# Altium schematic sheet RelayController.SchDoc
size A4
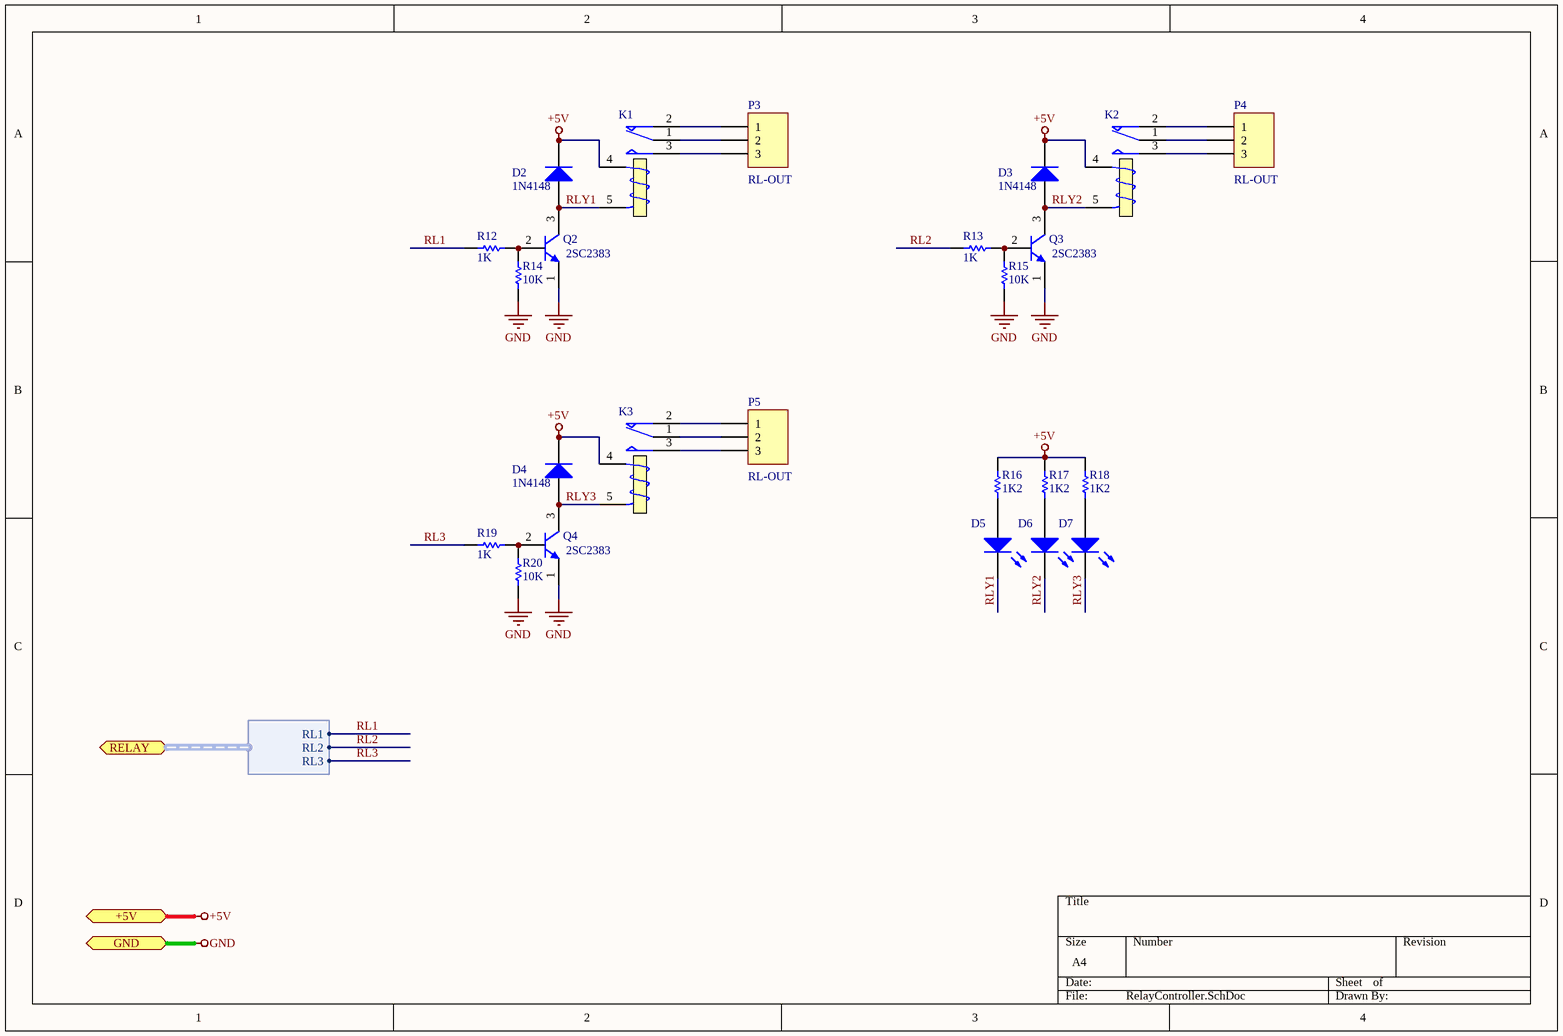
[diagram p0: RelayController.SchDoc]

## Parts
D2  1N4148  [D-DO213-AA]
D3  1N4148  [D-DO213-AA]
D4  1N4148  [D-DO213-AA]
D5  SMD0805-RED  [LED-0805]  (value not drawn)
D6  SMD0805-RED  [LED-0805]  (value not drawn)
D7  SMD0805-RED  [LED-0805]  (value not drawn)
K1  RL-5P-10A  [RL-5P-10A]  (value not drawn)
K2  RL-5P-10A  [RL-5P-10A]  (value not drawn)
K3  RL-5P-10A  [RL-5P-10A]  (value not drawn)
P3  value RL-OUT  [TER-KF128-3P]  (hidden comment: KF128-3P)
P4  value RL-OUT  [TER-KF128-3P]  (hidden comment: KF128-3P)
P5  value RL-OUT  [TER-KF128-3P]  (hidden comment: KF128-3P)
Q2  value 2SC2383  [TO-92AB]  (hidden comment: C2383)
Q3  value 2SC2383  [TO-92AB]  (hidden comment: C2383)
Q4  value 2SC2383  [TO-92AB]  (hidden comment: C2383)
R12  1K  [R-0805]
R13  1K  [R-0805]
R14  10K  [R-0805]
R15  10K  [R-0805]
R16  1K2  [R-0805]
R17  1K2  [R-0805]
R18  1K2  [R-0805]
R19  1K  [R-0805]
R20  10K  [R-0805]

## Ports
+5V, GND, RELAY (harness RELAY)

## Harnesses
RELAY: RL1, RL2, RL3

## Nets
+5V: D2.2(K) D3.2(K) D4.2(K) K1.4(T1) K2.4(T1) K3.4(T1) R16.2 R17.2 R18.2 ; port +5V
GND: Q2.1(E) Q3.1(E) Q4.1(E) R14.2 R15.2 R20.2 ; port GND
RL1: R12.2 ; port RELAY.RL1
RL2: R13.2 ; port RELAY.RL2
RL3: R19.2 ; port RELAY.RL3
RLY1: D2.1(A) D5.2(K) K1.5(T2) Q2.3(C)
RLY2: D3.1(A) D6.2(K) K2.5(T2) Q3.3(C)
RLY3: D4.1(A) D7.2(K) K3.5(T2) Q4.3(C)
NetD5_1: D5.1(A) R16.1
NetD6_1: D6.1(A) R17.1
NetD7_1: D7.1(A) R18.1
NetK1_1: K1.1(COM) P3.2
NetK1_2: K1.2(NC) P3.1
NetK1_3: K1.3(NO) P3.3
NetK2_1: K2.1(COM) P4.2
NetK2_2: K2.2(NC) P4.1
NetK2_3: K2.3(NO) P4.3
NetK3_1: K3.1(COM) P5.2
NetK3_2: K3.2(NC) P5.1
NetK3_3: K3.3(NO) P5.3
NetQ2_2: Q2.2(B) R12.1 R14.1
NetQ3_2: Q3.2(B) R13.1 R15.1
NetQ4_2: Q4.2(B) R19.1 R20.1

## Library data of the parts
D2-D4 = Diode 1N4148: High Conductance Fast Diode; Published: 8-Jun-2000; LatestRevisionDate: 17-Jul-2002; LatestRevisionNote: Re-released for DXP Platform.; DatasheetVersion: 1997; PackageReference: DO-35; Value: 1N4148; PackageDescription: Diode, Axial; Body 3.8 x 1.9 mm (LxDia. max), Lead Dia. 0.53 mm (max); Code_JEDEC: DO-204-AH; ComponentLink1Description: Manufacturer Link; ComponentLink1URL: http://www.fairchildsemi.com/; ComponentLink2Description: Datasheet; ComponentLink2URL: http://www.fairchildsemi.com/ds/1N%2F1N4148.pdf
D5-D7 = LED0: Typical INFRARED GaAs LED; Value: StatusLed; Published: 8-Jun-2000; LatestRevisionDate: 08-Jul-2005; LatestRevisionNote: Mech Layer 1 removed.; PackageReference: LED-0
K1-K3 = Relay: SPDT Relay; Value: 5V/10A; Published: 8-Jun-2000; LatestRevisionDate: 17-Jul-2002; LatestRevisionNote: Re-released for DXP Platform.; PackageReference: MODULE5B
P3-P5 = Header 3: Header, 3-Pin; LatestRevisionDate: 17-Jul-2002; LatestRevisionNote: Re-released for DXP Platform.
Q2-Q4 = NPN: NPN Bipolar Transistor; Published: 8-Jun-2000; LatestRevisionDate: 17-Jul-2002; LatestRevisionNote: Re-released for DXP Platform.; PackageReference: TO-226-AA; PackageDescription: TO, Flat Index; 3 In-Line, Axial Leads; Body Dia. 4.8mm; Leads 0.55 x 0.51 mm (max); Code_JEDEC: TO-226-AA
R12-R20 = Res1: Resistor; Published: 8-Jun-2000; LatestRevisionDate: 17-Jul-2002; LatestRevisionNote: Re-released for DXP Platform.; PackageReference: AXIAL-0.3; Publisher: Altium Limited; PackageDescription: Axial Device, Thru-Hole; 2 Leads; 0.3 in Pin Spacing
  R12 R13 R19: Value: 1K
  R14 R15 R20: Value: 10K
  R16-R18: Value: 1K2